# Altium project FPGA.PrjPCB
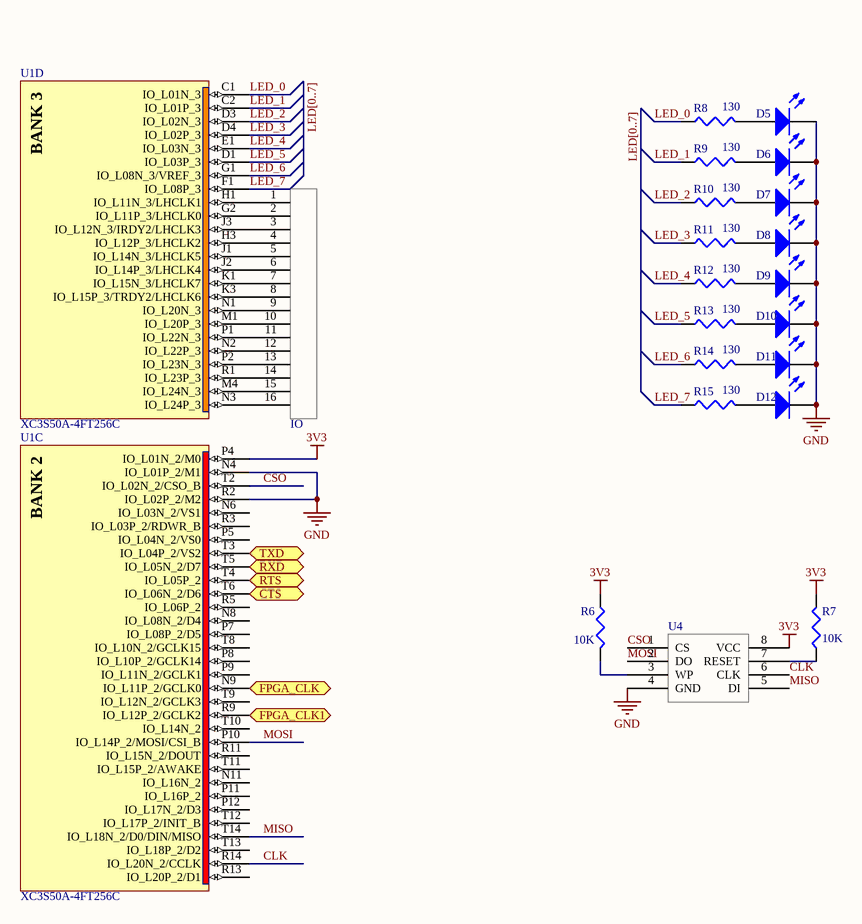
[diagram p0: IO.SchDoc]
2 sheets, 52 parts. Net scope: flat (ports and power ports of the same name join across sheets).
Board file: FPGA.PcbDoc
Sheets:
  IO.SchDoc
  Power.SchDoc

## Sheet IO.SchDoc
size A

### Parts
?  IO  [PCBComponent_1]
D5  LED3  [1608[0603]]  (value not drawn)
D6  LED3  [1608[0603]]  (value not drawn)
D7  LED3  [1608[0603]]  (value not drawn)
D8  LED3  [1608[0603]]  (value not drawn)
D9  LED3  [1608[0603]]  (value not drawn)
D10  LED3  [1608[0603]]  (value not drawn)
D11  LED3  [1608[0603]]  (value not drawn)
D12  LED3  [1608[0603]]  (value not drawn)
R6  value 10K  [J1-0603]  (hidden comment: Res3)
R7  value 10K  [J1-0603]  (hidden comment: Res3)
R8  value 130  [J1-0603]  (hidden comment: Res3)
R9  value 130  [J1-0603]  (hidden comment: Res3)
R10  value 130  [J1-0603]  (hidden comment: Res3)
R11  value 130  [J1-0603]  (hidden comment: Res3)
R12  value 130  [J1-0603]  (hidden comment: Res3)
R13  value 130  [J1-0603]  (hidden comment: Res3)
R14  value 130  [J1-0603]  (hidden comment: Res3)
R15  value 130  [J1-0603]  (hidden comment: Res3)
U1  XC3S50A-4FT256C  [FT256]  (parts C,D of 9)
U4  W25Q80  [QFN127P500X600X80_HS-9N]  (value not drawn)

### Ports
CTS (out), FPGA_CLK1 (in), FPGA_CLK (in), RTS (in), RXD (out), TXD (in)

### Nets
3V3: R6.1 R7.2 U1.P4(IO_L01N_2/M0) U4.8(VCC)
GND: D5.2(K) D6.2(K) D7.2(K) D8.2(K) D9.2(K) D10.2(K) D11.2(K) D12.2(K) U1.N4(IO_L01P_2/M1) U1.R2(IO_L02P_2/M2) U4.4(GND)
CLK: U1.R14(IO_L20N_2/CCLK) U4.6(CLK)
CSO: U1.T2(IO_L02N_2/CSO_B) U4.1(CS)
LED_0: R8.1 U1.C1(IO_L01N_3)
LED_1: R9.1 U1.C2(IO_L01P_3)
LED_2: R10.1 U1.D3(IO_L02N_3)
LED_3: R11.1 U1.D4(IO_L02P_3)
LED_4: R12.1 U1.E1(IO_L03N_3)
LED_5: R13.1 U1.D1(IO_L03P_3)
LED_6: R14.1 U1.G1(IO_L08N_3/VREF_3)
LED_7: R15.1 U1.F1(IO_L08P_3)
MISO: U1.T14(IO_L18N_2/D0/DIN/MISO) U4.5(DI)
MOSI: U1.P10(IO_L14P_2/MOSI/CSI_B) U4.2(DO)
Net?_1: ?.1 U1.H1(IO_L11N_3/LHCLK1)
Net?_2: ?.2 U1.G2(IO_L11P_3/LHCLK0)
Net?_3: ?.3 U1.J3(IO_L12N_3/IRDY2/LHCLK3)
Net?_4: ?.4 U1.H3(IO_L12P_3/LHCLK2)
Net?_5: ?.5 U1.J1(IO_L14N_3/LHCLK5)
Net?_6: ?.6 U1.J2(IO_L14P_3/LHCLK4)
Net?_7: ?.7 U1.K1(IO_L15N_3/LHCLK7)
Net?_8: ?.8 U1.K3(IO_L15P_3/TRDY2/LHCLK6)
Net?_9: ?.9 U1.N1(IO_L20N_3)
Net?_10: ?.10 U1.M1(IO_L20P_3)
Net?_11: ?.11 U1.P1(IO_L22N_3)
Net?_12: ?.12 U1.N2(IO_L22P_3)
Net?_13: ?.13 U1.P2(IO_L23N_3)
Net?_14: ?.14 U1.R1(IO_L23P_3)
Net?_15: ?.15 U1.M4(IO_L24N_3)
Net?_16: ?.16 U1.N3(IO_L24P_3)
NetD5_1: D5.1(A) R8.2
NetD6_1: D6.1(A) R9.2
NetD7_1: D7.1(A) R10.2
NetD8_1: D8.1(A) R11.2
NetD9_1: D9.1(A) R12.2
NetD10_1: D10.1(A) R13.2
NetD11_1: D11.1(A) R14.2
NetD12_1: D12.1(A) R15.2
NetR6_2: R6.2 U4.3(WP)
NetR7_1: R7.1 U4.7(RESET)
NetU1_N9: U1.N9(IO_L11P_2/GCLK0) ; port FPGA_CLK
NetU1_R9: U1.R9(IO_L12P_2/GCLK2) ; port FPGA_CLK1
NetU1_T3: U1.T3(IO_L04P_2/VS2) ; port TXD
NetU1_T4: U1.T4(IO_L05P_2) ; port RTS
NetU1_T5: U1.T5(IO_L05N_2/D7) ; port RXD
NetU1_T6: U1.T6(IO_L06N_2/D6) ; port CTS

Not connected (* = marked no-connect by the designer): U1 N6(IO_L03N_2/VS1) N8(IO_L08N_2/D4) N11(IO_L16N_2) P5(IO_L04N_2/VS0) P7(IO_L08P_2/D5) P8(IO_L10P_2/GCLK14) P9(IO_L11N_2/GCLK1) P11(IO_L16P_2) P12(IO_L17N_2/D3) R3(IO_L03P_2/RDWR_B) R5(IO_L06P_2) R11(IO_L15N_2/DOUT) R13(IO_L20P_2/D1) T8(IO_L10N_2/GCLK15) T9(IO_L12N_2/GCLK3) T10(IO_L14N_2) T11(IO_L15P_2/AWAKE) T12(IO_L17P_2/INIT_B) T13(IO_L18P_2/D2)

### Buses and harness runs
bus LED[0..7]

### Notes on the sheet
- (in symbol XC3S50A-4FT256C, part C) BANK 2
- (in symbol XC3S50A-4FT256C, part D) BANK 3

### Library data of the parts
? U4 = Component_1
D5-D12 = LED3: Typical BLUE SiC LED; Published: 8-Jun-2000; LatestRevisionDate: 17-Dec-2003; LatestRevisionNote: PCB Footprint replaced.; DatasheetVersion: 16-Apr-2002; PackageVersion: 16-Apr-2002; PackageReference: 3.5X2.8X1.9; Publisher: Altium Limited; PackageDescription: SM LED; 2 C-Bend Leads; Body 3.5 x 2.8 x 1.9 mm, inc leads (LxWxH typ)
R6-R15 = Res3: Resistor; Published: 8-Jun-2000; LatestRevisionDate: 29-May-2009; LatestRevisionNote: IPC-7351 Footprint Added.; PackageReference: J1-0603; Publisher: Altium Limited; PackageDescription: Chip Resistor
U1 = XC3S50A-4FT256C: Spartan-3A I/O Optimized FPGA, 144 User I/Os, 256-Ball FTBGA, Standard Performance, Commercial Grade; Published: 12-Dec-2006; LatestRevisionDate: 24-Apr-2009; LatestRevisionNote: Updated to datasheet version 1.8 Mar-2009; DatasheetVersion: ver1.8, Mar-2009; PackageVersion: ver1.3, Oct-2007; PackageReference: FT256; Publisher: Altium Limited; PackageDescription: 256-Ball Fine Pitch Thin Ball Grid Array 1.00 mm Pitch (FT256); Supplier 1: Digi-Key; Supplier Part Number 1: XC3S50A-4FT256C-ND; Code_JEDEC: MS-034-AAF-1*; ComponentLink1Description: Spartan-3A Datasheet; ComponentLink1URL: http://www.xilinx.com/support/documentation/data_sheets/ds529.pdf; ComponentLink2Description: FT256 Package Drawing; ComponentLink2URL: http://www.xilinx.com/support/documentation/package_specs/ft256.pdf; ComponentLink3Description: Spartan-3A Documents; ComponentLink3URL: http://www.xilinx.com/support/documentation/spartan-3a.htm; ComponentLink4Description: Xilinx.com Home; ComponentLink4URL: http://www.xilinx.com

## Sheet Power.SchDoc
size A
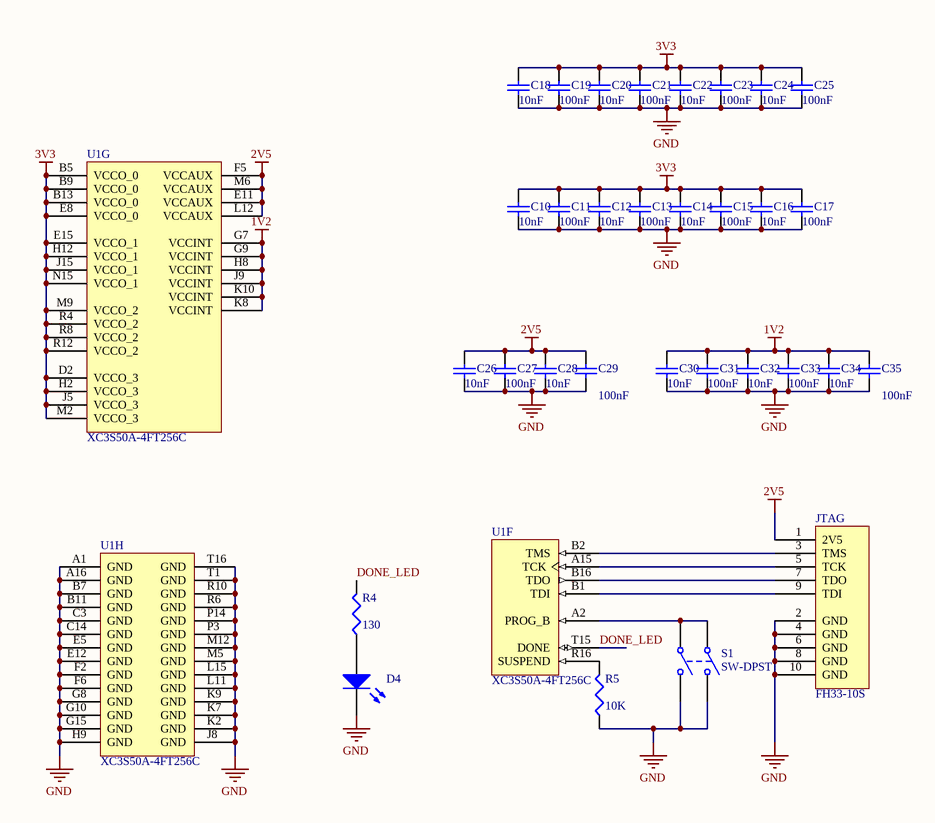
[diagram p1: Power.SchDoc]

### Parts
C10  value 10nF  [0402]  (hidden comment: Cap Semi)
C11  value 100nF  [0402]  (hidden comment: Cap Semi)
C12  value 10nF  [0402]  (hidden comment: Cap Semi)
C13  value 100nF  [0402]  (hidden comment: Cap Semi)
C14  value 10nF  [0402]  (hidden comment: Cap Semi)
C15  value 100nF  [0402]  (hidden comment: Cap Semi)
C16  value 10nF  [0402]  (hidden comment: Cap Semi)
C17  value 100nF  [0402]  (hidden comment: Cap Semi)
C18  value 10nF  [0402]  (hidden comment: Cap Semi)
C19  value 100nF  [0402]  (hidden comment: Cap Semi)
C20  value 10nF  [0402]  (hidden comment: Cap Semi)
C21  value 100nF  [0402]  (hidden comment: Cap Semi)
C22  value 10nF  [0402]  (hidden comment: Cap Semi)
C23  value 100nF  [0402]  (hidden comment: Cap Semi)
C24  value 10nF  [0402]  (hidden comment: Cap Semi)
C25  value 100nF  [0402]  (hidden comment: Cap Semi)
C26  value 10nF  [0402]  (hidden comment: Cap Semi)
C27  value 100nF  [0402]  (hidden comment: Cap Semi)
C28  value 10nF  [0402]  (hidden comment: Cap Semi)
C29  value 100nF  [0402]  (hidden comment: Cap Semi)
C30  value 10nF  [0402]  (hidden comment: Cap Semi)
C31  value 100nF  [0402]  (hidden comment: Cap Semi)
C32  value 10nF  [0402]  (hidden comment: Cap Semi)
C33  value 100nF  [0402]  (hidden comment: Cap Semi)
C34  value 10nF  [0402]  (hidden comment: Cap Semi)
C35  value 100nF  [0402]  (hidden comment: Cap Semi)
D4  LED3  [1608[0603]]  (value not drawn)
JTAG  FH33-10S  [PCBComponent_1 - duplicate]
R4  value 130  [J1-0603]  (hidden comment: Res3)
R5  value 10K  [J1-0603]  (hidden comment: Res3)
S1  SW-DPST  [DPST-4]
U1  XC3S50A-4FT256C  [FT256]  (parts F,G,H of 9)

### Nets
1V2: C30.1 C31.1 C32.1 C33.1 C34.1 C35.1 U1.G7(VCCINT) U1.G9(VCCINT) U1.H8(VCCINT) U1.J9(VCCINT) U1.K8(VCCINT) U1.K10(VCCINT)
2V5: C26.1 C27.1 C28.1 C29.1 JTAG.1(2V5) U1.E11(VCCAUX) U1.F5(VCCAUX) U1.L12(VCCAUX) U1.M6(VCCAUX)
3V3: C10.1 C11.1 C12.1 C13.1 C14.1 C15.1 C16.1 C17.1 C18.1 C19.1 C20.1 C21.1 C22.1 C23.1 C24.1 C25.1 U1.B5(VCCO_0) U1.B9(VCCO_0) U1.B13(VCCO_0) U1.D2(VCCO_3) U1.E8(VCCO_0) U1.E15(VCCO_1) U1.H2(VCCO_3) U1.H12(VCCO_1) U1.J5(VCCO_3) U1.J15(VCCO_1) U1.M2(VCCO_3) U1.M9(VCCO_2) U1.N15(VCCO_1) U1.R4(VCCO_2) U1.R8(VCCO_2) U1.R12(VCCO_2)
GND: C10.2 C11.2 C12.2 C13.2 C14.2 C15.2 C16.2 C17.2 C18.2 C19.2 C20.2 C21.2 C22.2 C23.2 C24.2 C25.2 C26.2 C27.2 C28.2 C29.2 C30.2 C31.2 C32.2 C33.2 C34.2 C35.2 D4.2(K) JTAG.2(GND) JTAG.4(GND) JTAG.6(GND) JTAG.8(GND) JTAG.10(GND) R5.1 S1.2(NO1) S1.4(NO2) U1.A1(GND) U1.A16(GND) U1.B7(GND) U1.B11(GND) U1.C3(GND) U1.C14(GND) U1.E5(GND) U1.E12(GND) U1.F2(GND) U1.F6(GND) U1.G8(GND) U1.G10(GND) U1.G15(GND) U1.H9(GND) U1.J8(GND) U1.K2(GND) U1.K7(GND) U1.K9(GND) U1.L11(GND) U1.L15(GND) U1.M5(GND) U1.M12(GND) U1.P3(GND) U1.P14(GND) U1.R6(GND) U1.R10(GND) U1.T1(GND) U1.T16(GND)
DONE_LED: R4.2 U1.T15(DONE)
NetD4_1: D4.1(A) R4.1
NetJTAG_3: JTAG.3(TMS) U1.B2(TMS)
NetJTAG_5: JTAG.5(TCK) U1.A15(TCK)
NetJTAG_7: JTAG.7(TDO) U1.B16(TDO)
NetJTAG_9: JTAG.9(TDI) U1.B1(TDI)
NetR5_2: R5.2 U1.R16(SUSPEND)
NetS1_1: S1.1(COMMON1) S1.3(COMMON2) U1.A2(PROG_B)

### Library data of the parts
C10-C35 = Cap Semi: Capacitor (Semiconductor SIM Model); Published: 8-Jun-2000; LatestRevisionDate: 29-May-2009; LatestRevisionNote: IPC-7351 Footprint Added.; PackageReference: C1206; Publisher: Altium Limited; PackageDescription: Chip Capacitor
D4 = LED3: Typical BLUE SiC LED; Published: 8-Jun-2000; LatestRevisionDate: 17-Dec-2003; LatestRevisionNote: PCB Footprint replaced.; DatasheetVersion: 16-Apr-2002; PackageVersion: 16-Apr-2002; PackageReference: 3.5X2.8X1.9; Publisher: Altium Limited; PackageDescription: SM LED; 2 C-Bend Leads; Body 3.5 x 2.8 x 1.9 mm, inc leads (LxWxH typ)
JTAG = Component_1
R4 R5 = Res3: Resistor; Published: 8-Jun-2000; LatestRevisionDate: 29-May-2009; LatestRevisionNote: IPC-7351 Footprint Added.; PackageReference: J1-0603; Publisher: Altium Limited; PackageDescription: Chip Resistor
S1 = SW-DPST: Double-Pole, Single-Throw Switch; Published: 24-Mar-1999; LatestRevisionDate: 17-Jul-2002; LatestRevisionNote: Re-released for DXP Platform.; PackageReference: DPST-4; Publisher: Altium Limited; PackageDescription: Switch; 4 Leads
U1 = XC3S50A-4FT256C: as U1 on sheet IO; Published: 12-Dec-2006; LatestRevisionDate: 24-Apr-2009; LatestRevisionNote: Updated to datasheet version 1.8 Mar-2009; DatasheetVersion: ver1.8, Mar-2009; PackageVersion: ver1.3, Oct-2007; PackageReference: FT256; Publisher: Altium Limited; PackageDescription: 256-Ball Fine Pitch Thin Ball Grid Array 1.00 mm Pitch (FT256); Supplier 1: Digi-Key; Supplier Part Number 1: XC3S50A-4FT256C-ND; Code_JEDEC: MS-034-AAF-1*; ComponentLink1Description: Spartan-3A Datasheet; ComponentLink1URL: http://www.xilinx.com/support/documentation/data_sheets/ds529.pdf; ComponentLink2Description: FT256 Package Drawing; ComponentLink2URL: http://www.xilinx.com/support/documentation/package_specs/ft256.pdf; ComponentLink3Description: Spartan-3A Documents; ComponentLink3URL: http://www.xilinx.com/support/documentation/spartan-3a.htm; ComponentLink4Description: Xilinx.com Home; ComponentLink4URL: http://www.xilinx.com

## Nets that join several sheets
3V3: IO (R6.1 R7.2 U1.P4 U4.8), Power (32 pins)
GND: IO (11 pins), Power (63 pins)